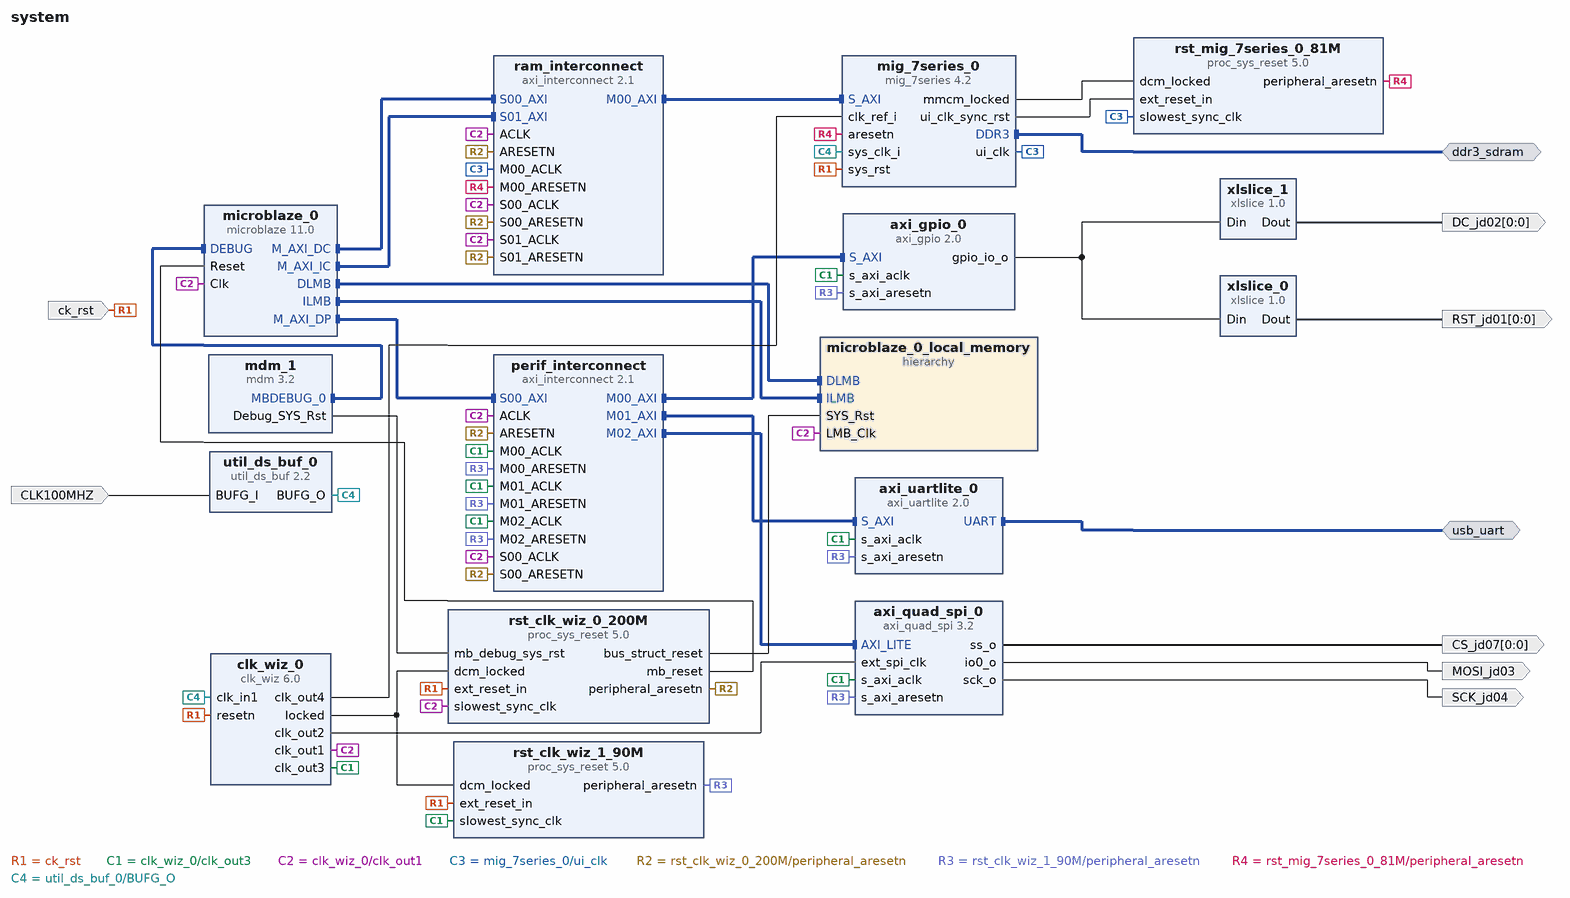
[diagram p0: block diagram of the top level]
# Vivado block design system, xc7a35ticsg324-1L, Vivado 2023.1
create_bd_design system

create_bd_intf_port -mode Master -vlnv xilinx.com:interface:ddrx_rtl:1.0 ddr3_sdram
create_bd_intf_port -mode Master -vlnv xilinx.com:interface:uart_rtl:1.0 usb_uart
create_bd_port -dir I -type clk CLK100MHZ
set_property -dict {CONFIG.FREQ_HZ 100000000} [get_bd_ports CLK100MHZ]
create_bd_port -dir I -type rst ck_rst
create_bd_port -dir O -from 0 -to 0 CS_jd07
create_bd_port -dir O -from 0 -to 0 RST_jd01
create_bd_port -dir O -from 0 -to 0 DC_jd02
create_bd_port -dir O -type data MOSI_jd03
create_bd_port -dir O -type clk SCK_jd04

create_bd_cell -type ip -vlnv xilinx.com:ip:mig_7series:4.2 mig_7series_0
set_property -dict [list \
  CONFIG.BOARD_MIG_PARAM ddr3_sdram \
  CONFIG.RESET_BOARD_INTERFACE Custom \
  CONFIG.XML_INPUT_FILE mig_a.prj \
] [get_bd_cells mig_7series_0]
create_bd_cell -type ip -vlnv xilinx.com:ip:util_ds_buf:2.2 util_ds_buf_0
set_property -dict {CONFIG.C_BUF_TYPE BUFG} [get_bd_cells util_ds_buf_0]
create_bd_cell -type ip -vlnv xilinx.com:ip:axi_uartlite:2.0 axi_uartlite_0
set_property -dict {CONFIG.UARTLITE_BOARD_INTERFACE usb_uart CONFIG.USE_BOARD_FLOW true} [get_bd_cells axi_uartlite_0]
create_bd_cell -type ip -vlnv xilinx.com:ip:axi_gpio:2.0 axi_gpio_0
set_property -dict {CONFIG.C_ALL_OUTPUTS 1 CONFIG.C_GPIO_WIDTH 2} [get_bd_cells axi_gpio_0]
create_bd_cell -type ip -vlnv xilinx.com:ip:microblaze:11.0 microblaze_0
set_property -dict [list \
  CONFIG.C_CACHE_BYTE_SIZE 16384 \
  CONFIG.C_DCACHE_BYTE_SIZE 32768 \
  CONFIG.C_DCACHE_LINE_LEN 8 \
  CONFIG.C_DCACHE_VICTIMS 8 \
  CONFIG.C_DEBUG_ENABLED 1 \
  CONFIG.C_D_AXI 1 \
  CONFIG.C_D_LMB 1 \
  CONFIG.C_ICACHE_LINE_LEN 8 \
  CONFIG.C_ICACHE_VICTIMS 8 \
  CONFIG.C_I_LMB 1 \
  CONFIG.C_NUMBER_OF_RD_ADDR_BRK 1 \
  CONFIG.C_NUMBER_OF_WR_ADDR_BRK 1 \
  CONFIG.G_TEMPLATE_LIST 9 \
] [get_bd_cells microblaze_0]
create_bd_cell -type hier microblaze_0_local_memory
create_bd_cell -type ip -vlnv xilinx.com:ip:mdm:3.2 mdm_1
create_bd_cell -type ip -vlnv xilinx.com:ip:proc_sys_reset:5.0 rst_clk_wiz_0_200M
create_bd_cell -type ip -vlnv xilinx.com:ip:axi_interconnect:2.1 perif_interconnect
set_property -dict {CONFIG.NUM_MI 3} [get_bd_cells perif_interconnect]
create_bd_cell -type ip -vlnv xilinx.com:ip:axi_interconnect:2.1 ram_interconnect
set_property -dict {CONFIG.NUM_MI 1 CONFIG.NUM_SI 2} [get_bd_cells ram_interconnect]
create_bd_cell -type ip -vlnv xilinx.com:ip:proc_sys_reset:5.0 rst_mig_7series_0_81M
create_bd_cell -type ip -vlnv xilinx.com:ip:axi_quad_spi:3.2 axi_quad_spi_0
set_property -dict [list \
  CONFIG.C_FIFO_DEPTH 256 \
  CONFIG.C_SCK_RATIO 2 \
  CONFIG.C_TYPE_OF_AXI4_INTERFACE 0 \
  CONFIG.C_USE_STARTUP 0 \
  CONFIG.FIFO_INCLUDED 1 \
] [get_bd_cells axi_quad_spi_0]
create_bd_cell -type ip -vlnv xilinx.com:ip:xlslice:1.0 xlslice_0
set_property -dict {CONFIG.DIN_WIDTH 2} [get_bd_cells xlslice_0]
create_bd_cell -type ip -vlnv xilinx.com:ip:xlslice:1.0 xlslice_1
set_property -dict {CONFIG.DIN_FROM 1 CONFIG.DIN_TO 1 CONFIG.DIN_WIDTH 2} [get_bd_cells xlslice_1]
create_bd_cell -type ip -vlnv xilinx.com:ip:clk_wiz:6.0 clk_wiz_0
set_property -dict [list \
  CONFIG.CLKOUT1_JITTER 137.903 \
  CONFIG.CLKOUT1_PHASE_ERROR 132.063 \
  CONFIG.CLKOUT1_REQUESTED_OUT_FREQ 160 \
  CONFIG.CLKOUT2_JITTER 182.402 \
  CONFIG.CLKOUT2_PHASE_ERROR 132.063 \
  CONFIG.CLKOUT2_REQUESTED_OUT_FREQ 40 \
  CONFIG.CLKOUT2_USED true \
  CONFIG.CLKOUT3_JITTER 145.728 \
  CONFIG.CLKOUT3_PHASE_ERROR 132.063 \
  CONFIG.CLKOUT3_REQUESTED_OUT_FREQ 120 \
  CONFIG.CLKOUT3_USED true \
  CONFIG.CLKOUT4_JITTER 132.221 \
  CONFIG.CLKOUT4_PHASE_ERROR 132.063 \
  CONFIG.CLKOUT4_REQUESTED_OUT_FREQ 200.000 \
  CONFIG.CLKOUT4_USED true \
  CONFIG.MMCM_CLKFBOUT_MULT_F 6.000 \
  CONFIG.MMCM_CLKIN1_PERIOD 10.0 \
  CONFIG.MMCM_CLKIN2_PERIOD 10.0 \
  CONFIG.MMCM_CLKOUT0_DIVIDE_F 3.750 \
  CONFIG.MMCM_CLKOUT1_DIVIDE 15 \
  CONFIG.MMCM_CLKOUT2_DIVIDE 5 \
  CONFIG.MMCM_CLKOUT3_DIVIDE 3 \
  CONFIG.MMCM_DIVCLK_DIVIDE 1 \
  CONFIG.NUM_OUT_CLKS 4 \
  CONFIG.PRIM_SOURCE No_buffer \
  CONFIG.RESET_PORT resetn \
  CONFIG.RESET_TYPE ACTIVE_LOW \
] [get_bd_cells clk_wiz_0]
create_bd_cell -type ip -vlnv xilinx.com:ip:proc_sys_reset:5.0 rst_clk_wiz_1_90M

# ---- hierarchy /microblaze_0_local_memory ----
current_bd_instance /microblaze_0_local_memory
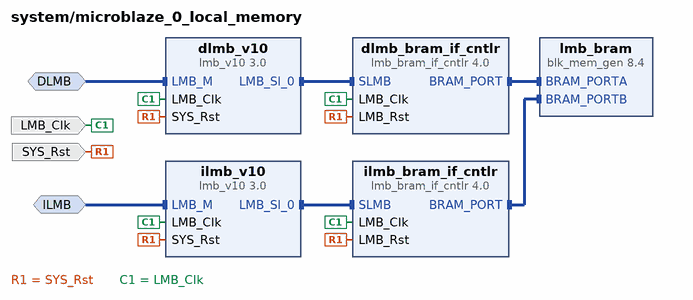
[diagram p1: block diagram inside /microblaze_0_local_memory]
create_bd_intf_pin -mode MirroredMaster -vlnv xilinx.com:interface:lmb_rtl:1.0 DLMB
create_bd_intf_pin -mode MirroredMaster -vlnv xilinx.com:interface:lmb_rtl:1.0 ILMB
create_bd_pin -dir I -type clk LMB_Clk
create_bd_pin -dir I -type rst SYS_Rst

create_bd_cell -type ip -vlnv xilinx.com:ip:lmb_v10:3.0 dlmb_v10
create_bd_cell -type ip -vlnv xilinx.com:ip:lmb_v10:3.0 ilmb_v10
create_bd_cell -type ip -vlnv xilinx.com:ip:lmb_bram_if_cntlr:4.0 dlmb_bram_if_cntlr
set_property -dict {CONFIG.C_ECC 0} [get_bd_cells dlmb_bram_if_cntlr]
create_bd_cell -type ip -vlnv xilinx.com:ip:lmb_bram_if_cntlr:4.0 ilmb_bram_if_cntlr
set_property -dict {CONFIG.C_ECC 0} [get_bd_cells ilmb_bram_if_cntlr]
create_bd_cell -type ip -vlnv xilinx.com:ip:blk_mem_gen:8.4 lmb_bram
set_property -dict {CONFIG.Memory_Type True_Dual_Port_RAM CONFIG.use_bram_block BRAM_Controller} [get_bd_cells lmb_bram]

# ---- connections ----

current_bd_instance /microblaze_0_local_memory
connect_bd_intf_net -intf_net microblaze_0_dlmb [get_bd_intf_pins dlmb_v10/LMB_M] [get_bd_intf_pins DLMB]
connect_bd_intf_net -intf_net microblaze_0_dlmb_bus [get_bd_intf_pins dlmb_v10/LMB_Sl_0] [get_bd_intf_pins dlmb_bram_if_cntlr/SLMB]
connect_bd_intf_net -intf_net microblaze_0_dlmb_cntlr [get_bd_intf_pins dlmb_bram_if_cntlr/BRAM_PORT] [get_bd_intf_pins lmb_bram/BRAM_PORTA]
connect_bd_intf_net -intf_net microblaze_0_ilmb [get_bd_intf_pins ilmb_v10/LMB_M] [get_bd_intf_pins ILMB]
connect_bd_intf_net -intf_net microblaze_0_ilmb_bus [get_bd_intf_pins ilmb_v10/LMB_Sl_0] [get_bd_intf_pins ilmb_bram_if_cntlr/SLMB]
connect_bd_intf_net -intf_net microblaze_0_ilmb_cntlr [get_bd_intf_pins ilmb_bram_if_cntlr/BRAM_PORT] [get_bd_intf_pins lmb_bram/BRAM_PORTB]
connect_bd_net [get_bd_pins SYS_Rst] \
  [get_bd_pins dlmb_v10/SYS_Rst] [get_bd_pins dlmb_bram_if_cntlr/LMB_Rst] [get_bd_pins ilmb_v10/SYS_Rst] \
  [get_bd_pins ilmb_bram_if_cntlr/LMB_Rst]
connect_bd_net -net microblaze_0_Clk [get_bd_pins LMB_Clk] \
  [get_bd_pins dlmb_v10/LMB_Clk] [get_bd_pins dlmb_bram_if_cntlr/LMB_Clk] [get_bd_pins ilmb_v10/LMB_Clk] \
  [get_bd_pins ilmb_bram_if_cntlr/LMB_Clk]
set_property HDL_ATTRIBUTE.BMM_INFO_ADDRESS_SPACE {byte  0x00000000 32 > system microblaze_0_local_memory/lmb_bram} [get_bd_cells dlmb_bram_if_cntlr]
set_property HDL_ATTRIBUTE.KEEP_HIERARCHY yes [get_bd_cells dlmb_bram_if_cntlr]

current_bd_instance /
connect_bd_intf_net [get_bd_intf_pins perif_interconnect/S00_AXI] [get_bd_intf_pins microblaze_0/M_AXI_DP]
connect_bd_intf_net [get_bd_intf_pins ram_interconnect/S00_AXI] [get_bd_intf_pins microblaze_0/M_AXI_DC]
connect_bd_intf_net [get_bd_intf_pins ram_interconnect/S01_AXI] [get_bd_intf_pins microblaze_0/M_AXI_IC]
connect_bd_intf_net [get_bd_intf_ports usb_uart] [get_bd_intf_pins axi_uartlite_0/UART]
connect_bd_intf_net [get_bd_intf_pins mdm_1/MBDEBUG_0] [get_bd_intf_pins microblaze_0/DEBUG]
connect_bd_intf_net [get_bd_intf_pins microblaze_0/DLMB] [get_bd_intf_pins microblaze_0_local_memory/DLMB]
connect_bd_intf_net [get_bd_intf_pins microblaze_0/ILMB] [get_bd_intf_pins microblaze_0_local_memory/ILMB]
connect_bd_intf_net [get_bd_intf_ports ddr3_sdram] [get_bd_intf_pins mig_7series_0/DDR3]
connect_bd_intf_net [get_bd_intf_pins axi_gpio_0/S_AXI] [get_bd_intf_pins perif_interconnect/M00_AXI]
connect_bd_intf_net [get_bd_intf_pins axi_uartlite_0/S_AXI] [get_bd_intf_pins perif_interconnect/M01_AXI]
connect_bd_intf_net [get_bd_intf_pins axi_quad_spi_0/AXI_LITE] [get_bd_intf_pins perif_interconnect/M02_AXI]
connect_bd_intf_net [get_bd_intf_pins mig_7series_0/S_AXI] [get_bd_intf_pins ram_interconnect/M00_AXI]
connect_bd_net [get_bd_ports CLK100MHZ] [get_bd_pins util_ds_buf_0/BUFG_I]
connect_bd_net [get_bd_pins axi_gpio_0/gpio_io_o] [get_bd_pins xlslice_0/Din] [get_bd_pins xlslice_1/Din]
connect_bd_net [get_bd_pins axi_quad_spi_0/io0_o] [get_bd_ports MOSI_jd03]
connect_bd_net [get_bd_pins axi_quad_spi_0/sck_o] [get_bd_ports SCK_jd04]
connect_bd_net [get_bd_pins axi_quad_spi_0/ss_o] [get_bd_ports CS_jd07]
connect_bd_net [get_bd_ports ck_rst] \
  [get_bd_pins mig_7series_0/sys_rst] [get_bd_pins rst_clk_wiz_0_200M/ext_reset_in] [get_bd_pins clk_wiz_0/resetn] \
  [get_bd_pins rst_clk_wiz_1_90M/ext_reset_in]
connect_bd_net [get_bd_pins clk_wiz_0/clk_out2] [get_bd_pins axi_quad_spi_0/ext_spi_clk]
connect_bd_net [get_bd_pins clk_wiz_0/clk_out4] [get_bd_pins mig_7series_0/clk_ref_i]
connect_bd_net -net clk_wiz_1_clk_out2 [get_bd_pins clk_wiz_0/clk_out3] \
  [get_bd_pins axi_quad_spi_0/s_axi_aclk] [get_bd_pins axi_gpio_0/s_axi_aclk] [get_bd_pins perif_interconnect/M00_ACLK] \
  [get_bd_pins axi_uartlite_0/s_axi_aclk] [get_bd_pins perif_interconnect/M01_ACLK] [get_bd_pins perif_interconnect/M02_ACLK] \
  [get_bd_pins rst_clk_wiz_1_90M/slowest_sync_clk]
connect_bd_net -net clk_wiz_1_locked [get_bd_pins clk_wiz_0/locked] \
  [get_bd_pins rst_clk_wiz_0_200M/dcm_locked] [get_bd_pins rst_clk_wiz_1_90M/dcm_locked]
connect_bd_net [get_bd_pins mdm_1/Debug_SYS_Rst] [get_bd_pins rst_clk_wiz_0_200M/mb_debug_sys_rst]
connect_bd_net -net microblaze_0_Clk [get_bd_pins clk_wiz_0/clk_out1] \
  [get_bd_pins microblaze_0/Clk] [get_bd_pins microblaze_0_local_memory/LMB_Clk] [get_bd_pins perif_interconnect/ACLK] \
  [get_bd_pins perif_interconnect/S00_ACLK] [get_bd_pins ram_interconnect/ACLK] [get_bd_pins ram_interconnect/S00_ACLK] \
  [get_bd_pins ram_interconnect/S01_ACLK] [get_bd_pins rst_clk_wiz_0_200M/slowest_sync_clk]
connect_bd_net [get_bd_pins mig_7series_0/mmcm_locked] [get_bd_pins rst_mig_7series_0_81M/dcm_locked]
connect_bd_net [get_bd_pins mig_7series_0/ui_clk] [get_bd_pins ram_interconnect/M00_ACLK] [get_bd_pins rst_mig_7series_0_81M/slowest_sync_clk]
connect_bd_net [get_bd_pins mig_7series_0/ui_clk_sync_rst] [get_bd_pins rst_mig_7series_0_81M/ext_reset_in]
connect_bd_net [get_bd_pins rst_clk_wiz_0_200M/bus_struct_reset] [get_bd_pins microblaze_0_local_memory/SYS_Rst]
connect_bd_net [get_bd_pins rst_clk_wiz_0_200M/mb_reset] [get_bd_pins microblaze_0/Reset]
connect_bd_net [get_bd_pins rst_clk_wiz_0_200M/peripheral_aresetn] \
  [get_bd_pins perif_interconnect/ARESETN] [get_bd_pins perif_interconnect/S00_ARESETN] \
  [get_bd_pins ram_interconnect/ARESETN] [get_bd_pins ram_interconnect/S00_ARESETN] \
  [get_bd_pins ram_interconnect/S01_ARESETN]
connect_bd_net -net rst_clk_wiz_0_90M_peripheral_aresetn [get_bd_pins rst_clk_wiz_1_90M/peripheral_aresetn] \
  [get_bd_pins perif_interconnect/M02_ARESETN] [get_bd_pins perif_interconnect/M01_ARESETN] \
  [get_bd_pins perif_interconnect/M00_ARESETN] [get_bd_pins axi_quad_spi_0/s_axi_aresetn] \
  [get_bd_pins axi_uartlite_0/s_axi_aresetn] [get_bd_pins axi_gpio_0/s_axi_aresetn]
connect_bd_net [get_bd_pins rst_mig_7series_0_81M/peripheral_aresetn] [get_bd_pins ram_interconnect/M00_ARESETN] [get_bd_pins mig_7series_0/aresetn]
connect_bd_net [get_bd_pins util_ds_buf_0/BUFG_O] [get_bd_pins mig_7series_0/sys_clk_i] [get_bd_pins clk_wiz_0/clk_in1]
connect_bd_net [get_bd_pins xlslice_0/Dout] [get_bd_ports RST_jd01]
connect_bd_net [get_bd_pins xlslice_1/Dout] [get_bd_ports DC_jd02]
set_property HDL_ATTRIBUTE.BMM_INFO_PROCESSOR {microblaze-le > system microblaze_0_local_memory/dlmb_bram_if_cntlr} [get_bd_cells microblaze_0]
set_property HDL_ATTRIBUTE.KEEP_HIERARCHY yes [get_bd_cells microblaze_0]

# ---- address map ----
assign_bd_address -offset 0x00000000 -range 16K -target_address_space [get_bd_addr_spaces microblaze_0/Data] [get_bd_addr_segs microblaze_0_local_memory/dlmb_bram_if_cntlr/SLMB/Mem]
assign_bd_address -offset 0x40000000 -range 64K -target_address_space [get_bd_addr_spaces microblaze_0/Data] [get_bd_addr_segs axi_gpio_0/S_AXI/Reg]
assign_bd_address -offset 0x40600000 -range 64K -target_address_space [get_bd_addr_spaces microblaze_0/Data] [get_bd_addr_segs axi_uartlite_0/S_AXI/Reg]
assign_bd_address -offset 0x44A00000 -range 64K -target_address_space [get_bd_addr_spaces microblaze_0/Data] [get_bd_addr_segs axi_quad_spi_0/AXI_LITE/Reg]
assign_bd_address -offset 0x80000000 -range 256M -target_address_space [get_bd_addr_spaces microblaze_0/Data] [get_bd_addr_segs mig_7series_0/memmap/memaddr]
assign_bd_address -offset 0x00000000 -range 16K -target_address_space [get_bd_addr_spaces microblaze_0/Instruction] [get_bd_addr_segs microblaze_0_local_memory/ilmb_bram_if_cntlr/SLMB/Mem]
assign_bd_address -offset 0x80000000 -range 256M -target_address_space [get_bd_addr_spaces microblaze_0/Instruction] [get_bd_addr_segs mig_7series_0/memmap/memaddr]

validate_bd_design
save_bd_design
